# Altium schematic sheet M1 Schematic 2.SchDoc: TX/RX Switch
size A; Date: Feb 27 2022; DrawnBy: Katherine Zhang; SheetNumber: 2; SheetTotal: 2
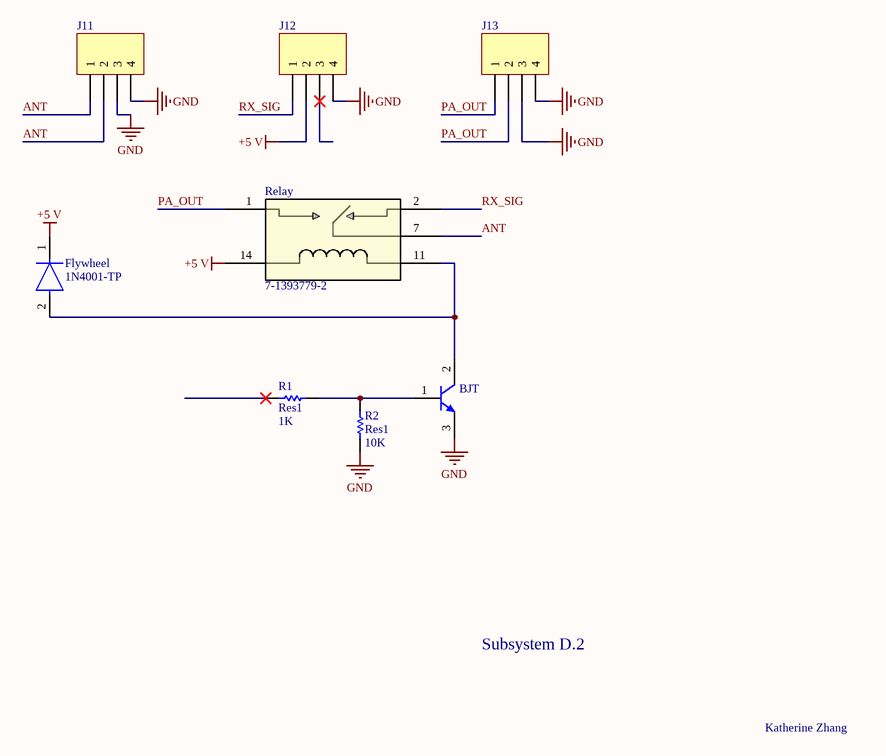
[diagram p0: M1 Schematic 2.SchDoc]

## Parts
BJT  2N2222A  [STM-TO-18-3]  (value not drawn)
Flywheel  1N4001-TP  [FP-DO-41-MFG]
J11  Header 4  [HDR1X4]  (value not drawn)
J12  Header 4  [HDR1X4]  (value not drawn)
J13  Header 4  [HDR1X4]  (value not drawn)
R1  Res1  value 1K  [AXIAL-0.1-RES]
R2  Res1  value 10K  [AXIAL-0.1-RES]
Relay  7-1393779-2  [RELAY_7-1393779-2]

## Nets
+5 V: Flywheel.1(C) J12.2 Relay.14
GND: BJT.3(E) J11.3 J11.4 J12.4 J13.3 J13.4 R2.1
ANT: J11.1 J11.2 Relay.7
PA_OUT: J13.1 J13.2 Relay.1
RX_SIG: J12.1 Relay.2
NetBJT_1: BJT.1(B) R1.2 R2.2
NetBJT_2: BJT.2(C) Flywheel.2(A) Relay.11

Not connected (* = marked no-connect by the designer): J12 3*; R1 1*

## Notes on the sheet
- Subsystem D.2
- Katherine Zhang

## Library data of the parts
BJT = CMP-2000-05381-1: High Speed Switch, 0.6 A IC, -65 to 175 degC, 3-Pin TO-18, RoHS, Bulk; Manufacturer: STMicroelectronics; Power Dissipation Pd: 500mW; DC Current Gain hFE: 300hFE; Transistor Polarity: NPN; DC Collector Current: 600mA; No. of Pins: 3Pins; Transition Frequency ft: 300MHz; Collector Emitter Voltage V(br)ceo: 40V; hFE Min: 40; Max Power Dissipation: 400mW; Number of Elements: 1; Collector Base Voltage (VCBO): 75V; Emitter Base Voltage (VEBO): 6V; Collector Emitter Saturation Voltage: 1V; Element Configuration: Single; Product Range: -; Package Reference: TO-18-3; Datasheet URL: https://datasheet.ciiva.com/25917/cd00003223-25917094.pdf; Automotive Qualification Standard: -; Transistor Case Style: TO-18; Operating Temperature Max: 175degC; Datasheet Version: Feb-03; Package Description: 3-Pin Through Hole Device, Dia 5.8 mm, Pitch 1.27 mm; Manufacturer URL: http://www.st.com/; Supplier 1: Digi-Key; Supplier Part Number 1: 497-2598-ND; Manufacturer Part Number: 2N2222A; RoHS: Yes; Category: BJTs; Mount: Through Hole; Case/Package: TO-18-3; Number of Pins: 3; Weight: 0.012346oz; Min Operating Temperature: -65°C; Max Operating Temperature: 175°C; Frequency: 300MHz; Packaging: Bulk; Package Quantity: 1000; Collector Emitter Voltage (VCEO): 40V; Polarity: NPN; Max Collector Current: 600mA; Collector Emitter Breakdown Voltage: 40V; Transition Frequency: 300MHz; Power Dissipation: 500mW; Max Frequency: 300MHz; Gain Bandwidth Product: 300MHz; Voltage Rating (DC): 75V; Current Rating: 600mA; Type: Switch; Collector-emitter Voltage-Max: 40V; Series: 2N2222; Continuous Collector Current: 600mA; Length: 5.8mm; Width: 5.8mm; Height: 1.5mm; Radiation Hardening: No; REACH SVHC: No SVHC; Lead Free: Contains Lead; RoHS Compliant: Yes; ComponentLink1URL: https://datasheet.ciiva.com/25917/cd00003223-25917094.pdf?src-supplier=Avnet+Europe; ComponentLink1Description: https://datasheet.ciiva.com/25917/cd00003223-25917094.pdf?src-supplier=Avnet+Europe; ComponentLink2URL: https://datasheet.ciiva.com/15192/getdatasheetpartid-292165-15192875.pdf?src-supplier=Verical; ComponentLink2Description: https://datasheet.ciiva.com/15192/getdatasheetpartid-292165-15192875.pdf?src-supplier=Verical; ComponentLink3URL: https://datasheet.ciiva.com/14166/2n2222a-eng-tds-14166093.pdf?src-supplier=Distrelec; ComponentLink3Description: https://datasheet.ciiva.com/14166/2n2222a-eng-tds-14166093.pdf?src-supplier=Distrelec; ComponentLink4URL: https://datasheet.ciiva.com/16427/cd00003223-16427384.pdf?src-supplier=Future+Electronics; ComponentLink4Description: https://datasheet.ciiva.com/16427/cd00003223-16427384.pdf?src-supplier=Future+Electronics; ComponentLink5URL: https://datasheet.ciiva.com/977/cd00003223-977271.pdf?src-supplier=Digi-Key; ComponentLink5Description: https://datasheet.ciiva.com/977/cd00003223-977271.pdf?src-supplier=Digi-Key; ComponentLink6URL: https://datasheet.ciiva.com/1194/1449532-1194083.pdf?src-supplier=Element14; ComponentLink6Description: https://datasheet.ciiva.com/1194/1449532-1194083.pdf?src-supplier=Element14; ComponentLink7URL: https://datasheet.ciiva.com/29323/163147-da-01-en-transistor-2-n-2222-a-to18-stm-29323030.pdf?src-supplier=Conrad; ComponentLink7Description: https://datasheet.ciiva.com/29323/163147-da-01-en-transistor-2-n-2222-a-to18-stm-29323030.pdf?src-supplier=Conrad
Flywheel = CMP-56207-000001-1: DIODE GEN PURP 50V 1A DO41; Manufacturer: Micro Commercial; Max Surge Forward Current: 30A; Max Junction Temp: +150°C; Capacitance: 15pF; Peak Reverse Current: 5uA; Value: 15pF; Forward Voltage: 1.1V; Recovery Time: 2000ns; Reverse Recovery Time: 2us; Element Configuration: Single; Polarity: Standard; Manufacturer Part Number: 1N4001-TP; Height: 2.7mm; Device Class L3: Rectifier Diodes; Octopart: https://octopart.com/1n4001-tp-mcc-730241; ComponentLink2URL: http://www.mccsemi.com/up_pdf/1N4001-1N4007(DO-41).pdf; ComponentLink2Description: Datasheet; Reverse Voltage: 50V; Lead Free: Yes; Temperature: -55°C to +150°C; Forward Current: 1A; RoHS: TRUE; Temperature Range Low: -55°C; Package: DO-41; Category: Diode; Temperature Range High: +150°C; Digikey Description: DIODE GEN PURP 50V 1A DO41; Ipc Land Pattern Name: DIOPA1114W105L520D270; Mouser Description: Rectifiers Vr/50V Io/1A; Max Repetitive Reverse Voltage: 50V; Device Class L1: Discrete Semiconductors; Automotive: No; Device Class L2: Diodes; Supplier 1: Digi-Key; Supplier Part Number 1: 1N4001-TPMSTR-ND; Pricing 1: 5000=0.03520, 10000=0.02992, 25000=0.02816, 50000=0.02640, 125000=0.02400 (USD); Mount: Through Hole; Case/Package: DO-41; Number of Pins: 2; Min Operating Temperature: -55°C; Max Operating Temperature: 150°C; Max Surge Current: 30A; Package Quantity: 5000; Packaging: Tape and Reel; Max Reverse Current: 5uA; Average Rectified Current: 1A; Max Forward Surge Current (Ifsm): 30A; Max Repetitive Reverse Voltage (Vrrm): 50V; Peak Non-Repetitive Surge Current: 30A; Voltage Rating (DC): 50V; Current Rating: 1A; Output Current: 1A; Max Reverse Voltage (DC): 50V; Diameter: 2.7mm; Length: 5.2mm; Radiation Hardening: No; REACH SVHC: Unknown; RoHS Compliant: Yes; ComponentLink1URL: https://datasheet.ciiva.com/7624/1684824-7624692.pdf?src-supplier=Element14; ComponentLink1Description: https://datasheet.ciiva.com/7624/1684824-7624692.pdf?src-supplier=Element14; ComponentLink3URL: https://datasheet.ciiva.com/911/1n4001-1n4007do-41-911653.pdf?src-supplier=Digi-Key; ComponentLink3Description: https://datasheet.ciiva.com/911/1n4001-1n4007do-41-911653.pdf?src-supplier=Digi-Key; ComponentLink4URL: https://datasheet.ciiva.com/911/1n4001-1n4007do-41-911654.pdf?src-supplier=Digi-Key; ComponentLink4Description: https://datasheet.ciiva.com/911/1n4001-1n4007do-41-911654.pdf?src-supplier=Digi-Key; ComponentLink5URL: https://datasheet.ciiva.com/14557/70055511-14557706.pdf?src-supplier=Allied+Electronics; ComponentLink5Description: https://datasheet.ciiva.com/14557/70055511-14557706.pdf?src-supplier=Allied+Electronics; ComponentLink6URL: https://datasheet.ciiva.com/16747/1n4001-1n4007do-41-16747013.pdf?src-supplier=Future+Electronics; ComponentLink6Description: https://datasheet.ciiva.com/16747/1n4001-1n4007do-41-16747013.pdf?src-supplier=Future+Electronics; ComponentLink7URL: https://datasheet.ciiva.com/28381/1684824-28381848.pdf?src-supplier=Element14; ComponentLink7Description: https://datasheet.ciiva.com/28381/1684824-28381848.pdf?src-supplier=Element14
J11-J13 = Header 4: Conn Header Vert 4POS 2.54MM; Manufacturer: Sullins; Manufacturer Part Number: PRPC004SAAN-RC; Number of Positions: 4; Connector Type: Male Pin; Pitch: 0.1inch; LatestRevisionDate: 17-Jul-2002; LatestRevisionNote: Re-released for DXP Platform.; Publisher: Altium Limited; Supplier 1: Digi-Key; Supplier Part Number 1: S1011EC-04-ND; RoHS: Yes; Category: Connectors; Stock 1: 11461; Pricing 1: 1=0.15000, 10=0.14600, 25=0.10840, 50=0.09280, 100=0.08980, 250=0.07740, 500=0.07430 (USD); Mount: Through Hole; Color: Black; Contact Plating: Gold; Package Quantity: 1; Number of Rows: 1; Packaging: Bulk; Termination: Solder; Series: -; Contact Type: Male Pin; Contact Mating Length: 0.23inch; RoHS Compliant: Yes; ComponentLink1URL: https://datasheet.ciiva.com/741/xrxczzzsxxn-rc-st-11635-b-741241.pdf?src-supplier=Digi-Key; ComponentLink1Description: https://datasheet.ciiva.com/741/xrxczzzsxxn-rc-st-11635-b-741241.pdf?src-supplier=Digi-Key
R1 = RES 1K OHM 5% 1/4W AXIAL: Resistor; Manufacturer Part Number: CFR-25JB-52-1K; Designator: R?; Power Rating: 1/4W; Tolerance: 0.05; Published: 8-Jun-2000; LatestRevisionDate: 17-Jul-2002; LatestRevisionNote: Re-released for DXP Platform.; Publisher: Altium Limited
R2 = RES 10K OHM 5% 1/4W AXIAL: Resistor; Manufacturer Part Number: CFR-25JB-52-10K; Designator: R?; Power Rating: 1/4W; Tolerance: 0.05; Published: 8-Jun-2000; LatestRevisionDate: 17-Jul-2002; LatestRevisionNote: Re-released for DXP Platform.; Publisher: Altium Limited
Relay = 7-1393779-2: No Description Available; Mfr_Name: TE Connectivity; Copyright: Copyright (C) 2022 Ultra Librarian. All rights reserved.; Manufacturer_Part_Number: 7-1393779-2; RefDes: RefDes; Type: DEV